# EAGLE design working (EAGLE 6.5.0)
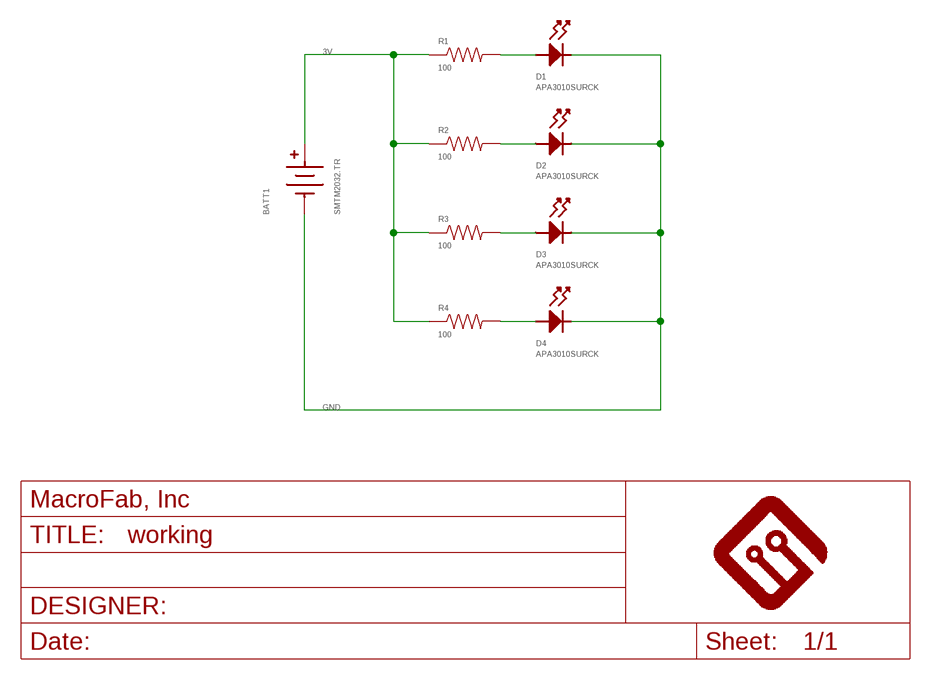
[diagram p0: schematic, sheet 1]

## Parts
BATT1  SMTM2032.TR  BATTERYSMTM2032  [SMTM2032]
D1  APA3010SURCK  LED_SINGLEAPA3010  [APA3010]
D2  APA3010SURCK  LED_SINGLEAPA3010  [APA3010]
D3  APA3010SURCK  LED_SINGLEAPA3010  [APA3010]
D4  APA3010SURCK  LED_SINGLEAPA3010  [APA3010]
R1  100  RESISTOR0805  [0805]
R2  100  RESISTOR0805  [0805]
R3  100  RESISTOR0805  [0805]
R4  100  RESISTOR0805  [0805]
U$1  MF_FRAMEMF_FRAME  [MF_FRAME]

## Nets
3V: BATT1.BATT+_0(+) BATT1.BATT+_1(+) R1.1 R2.1 R3.1 R4.1
GND: BATT1.BATT-(-) D1.1(CATHODE) D2.1(CATHODE) D3.1(CATHODE) D4.1(CATHODE)
N$2: D1.2(ANODE) R1.2
N$3: D2.2(ANODE) R2.2
N$4: D3.2(ANODE) R3.2
N$5: D4.2(ANODE) R4.2

## Library data of the parts
BATT1 = PP_Connectors:BATTERY
D1-D4 = PP_LED:LED_SINGLE
R1-R4 = PP_Passives:RESISTOR: Resistors
U$1 = PP_Aesthetics:MF_FRAME; DNAME: Parker Dillmann; REVNUM: REV 0

## Board
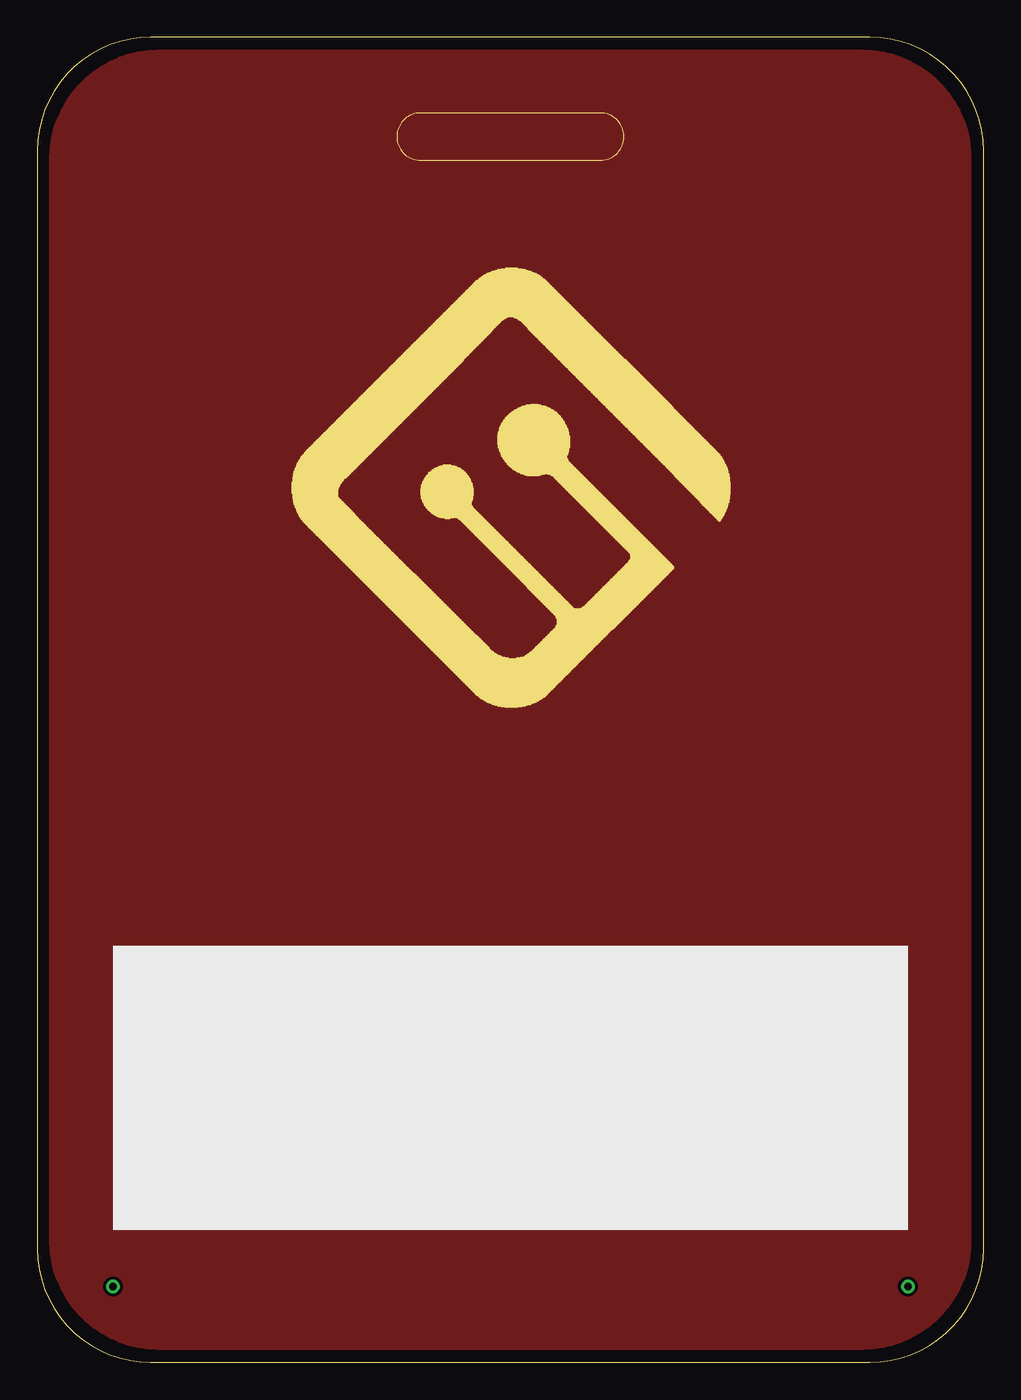
[diagram p1: board, top side]
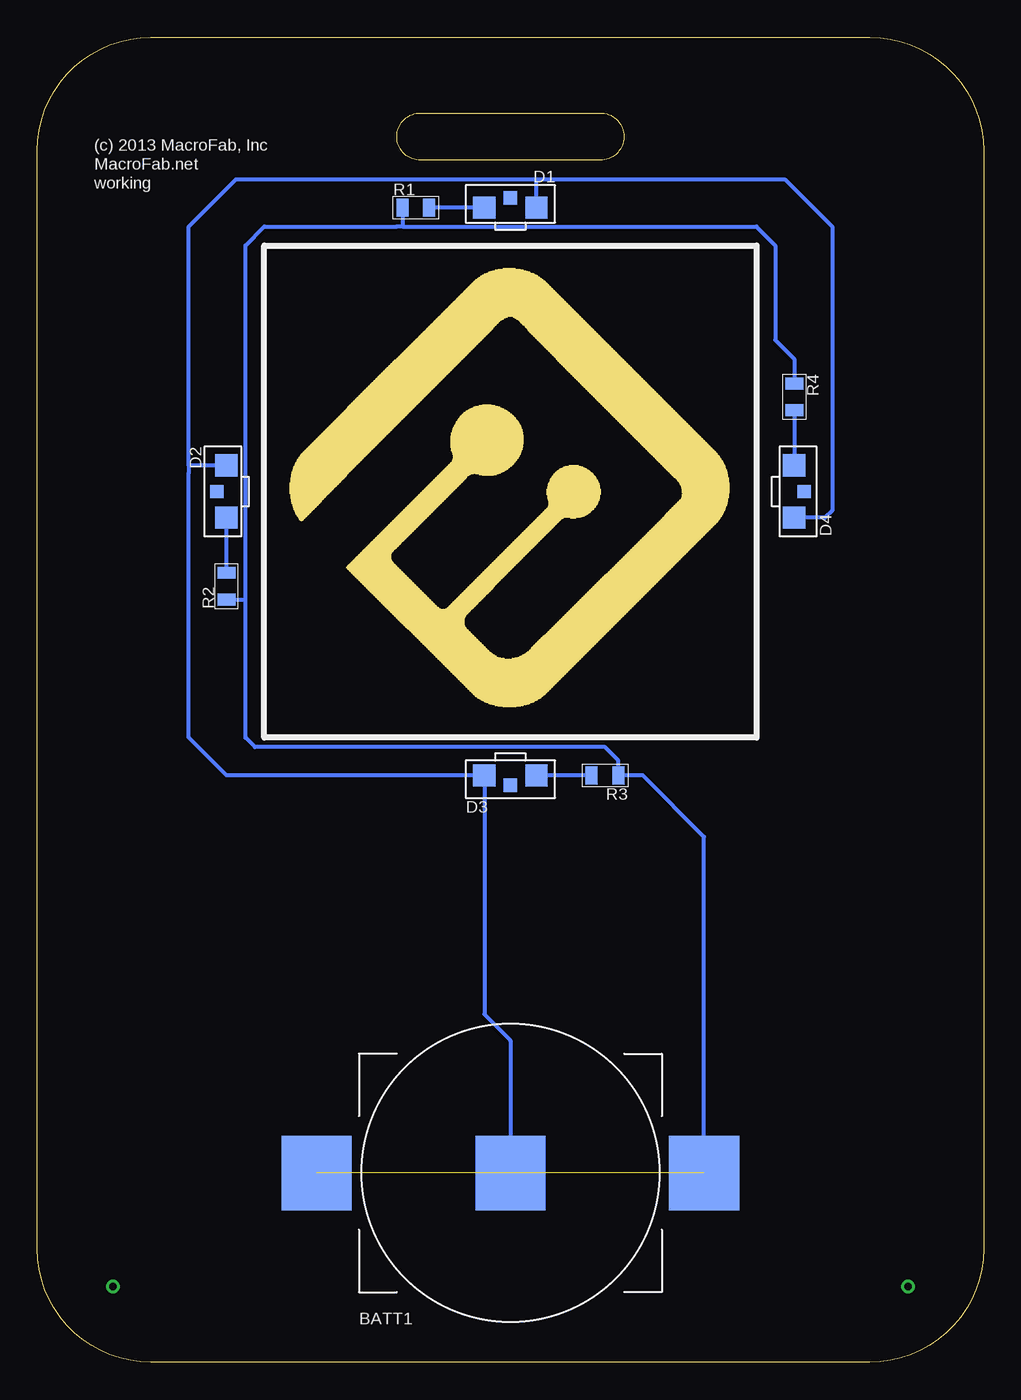
[diagram p2: board, bottom side, seen from below]

Size 63.5 x 88.9 mm. Coordinates in mm from the lower left corner, seen from the top.
Outline: 0,81.28 0,7.62 arc90 7.62,0 55.88,0 arc90 63.5,7.62 63.5,81.28 arc90 55.88,88.9 7.62,88.9 arc90 0,81.28
Outline: 39.37,82.23 arc90 37.78,83.82 25.72,83.82 arc90 24.13,82.23 arc90 25.72,80.64 37.78,80.64 arc90 39.37,82.23
Copper layers (1*16): Top 0.035mm / dielectric 1.5mm / Bottom 0.035mm
Design rules "default *": minimum track width 10mil, minimum drill 0.6mm, track to track 8mil, track to pad 8mil, pad to pad 8mil, via to via 8mil, smd to smd 8mil, copper to edge 0mil, drill to drill 8mil, minimum pad ring 10mil, minimum via ring 8mil, stop-mask expansion 4mil, vias tented up to drill 0mil, thermal gap 10mil

### Footprints (pad centres in the part's own frame; a part is rotated, then mirrored left to right if it is on the bottom)
SMTM2032 = smd 4.7 x 5: BATT+_0 -13,0; BATT+_1 13,0; BATT- 0,0
APA3010 = smd 1.5 x 1.5: 1 -1.75,0; 2 1.75,0 | smd 0.9 x 0.9: 3 0,-0.65
0805 = smd 0.8 x 1.2: 1 -0.9,0; 2 0.9,0

### Placement (x,y rotation side)
BATT1  31.75,12.7 0 bottom
D1  31.75,77.47 180 bottom
D2  50.8,58.42 270 bottom
D3  31.75,39.37 0 bottom
D4  12.7,58.42 90 bottom
R1  38.1,77.47 0 bottom
R2  50.8,52.07 90 bottom
R3  25.4,39.37 180 bottom
R4  12.7,64.77 270 bottom
U$1  59.69,82.55 0 bottom

### Tracks (layer width: path | path; a pad name or v marks a point on that pad's centre or on a via)
3V  (1 unrouted)
  Bottom 0.254: BATT1.BATT+_1 18.75,35.26 22.86,39.37 R3.1 24.5,40.38 25.4,41.27 48.9,41.27 49.53,41.91 49.53,51.17 | 49.53,51.17 49.53,74.93 48.26,76.2 39.37,76.2 39,76.2 | 39,76.2 15.24,76.2 13.97,74.93 13.97,68.58 12.7,67.31 R4.1 | R2.1 49.53,51.17 | R1.1 39,76.2
GND
  Bottom 0.254: D1.1 30,79.38 | BATT1.BATT- 31.75,21.59 33.5,23.34 D3.1 50.8,39.37 53.34,41.91 53.34,59.69 53.34,60.17 | 30,79.38 13.34,79.38 10.16,76.2 10.16,57.15 10.64,56.67 D4.1 | 53.34,60.17 53.34,76.2 50.16,79.38 30,79.38 | D2.1 53.34,60.17
N$1
  pour Top (rank 2, no thermals): 55.37,1.02 8.13,1.02 arc-90 1.02,8.13 1.02,80.77 arc-90 8.13,87.88 55.37,87.88 arc-90 62.48,80.77 62.48,8.13 arc-90
N$2
  Bottom 0.254: D1.2 R1.2
N$3
  Bottom 0.254: R2.2 D2.2
N$4
  Bottom 0.254: R3.2 D3.2
N$5
  Bottom 0.254: R4.2 D4.2
N$6  (via drill 0.5)
  other vias: 5.08,5.08
N$7  (via drill 0.5)
  other vias: 58.42,5.08